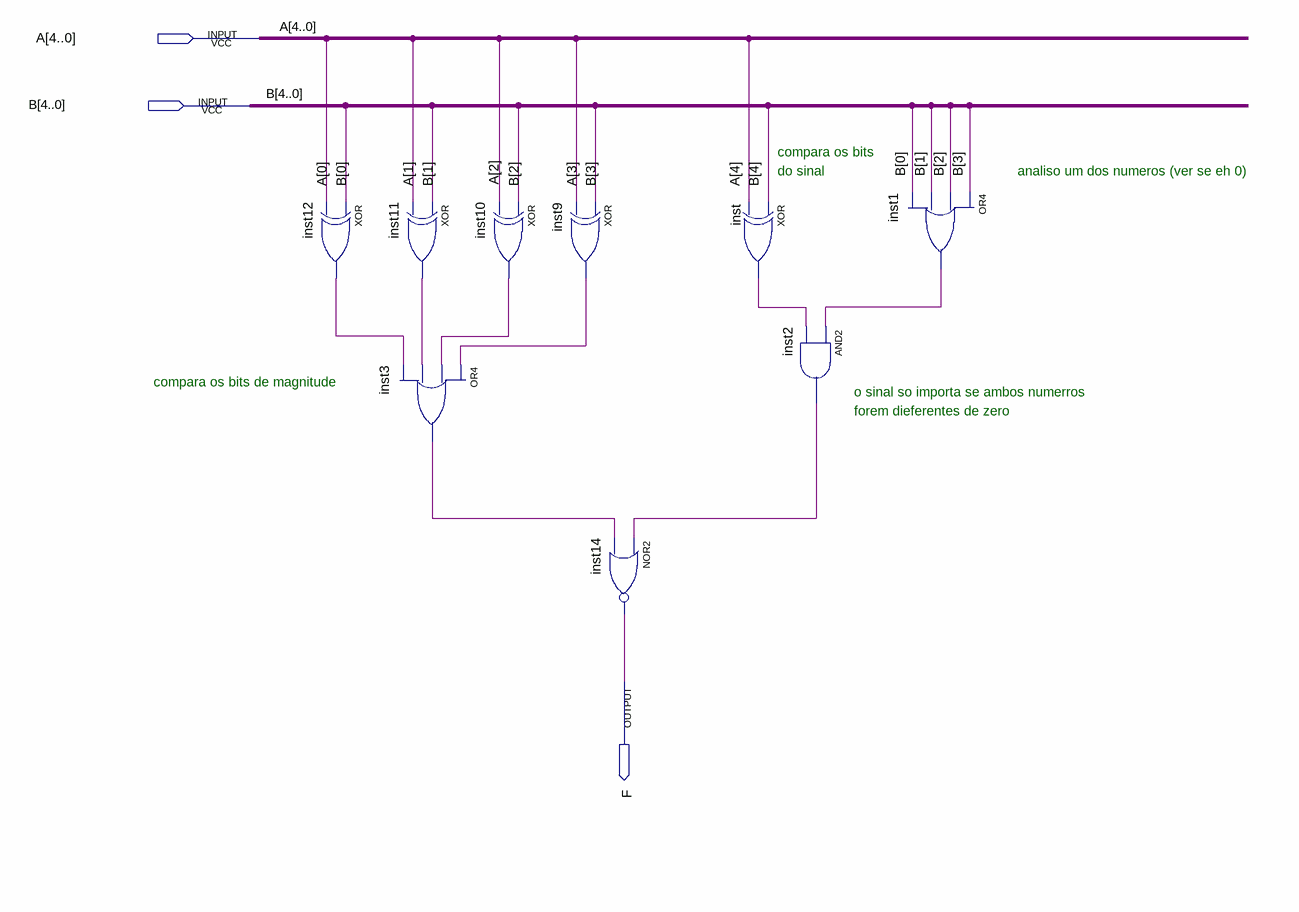
[diagram p0: schematic sheet]
// Quartus schematic comparador_igual.bdf as structural Verilog: 9 symbols, 3 pins
module comparador_igual (
  input  [4:0] A,
  input  [4:0] B,
  output F
);

  wire inst1_out, inst2_out, inst3_out, inst9_out, inst10_out, inst11_out, inst12_out, inst_out;

  xor inst12 (inst12_out, B[0], A[0]);
  xor inst11 (inst11_out, B[1], A[1]);
  or inst3 (inst3_out, inst9_out, inst10_out, inst11_out, inst12_out);
  xor inst10 (inst10_out, B[2], A[2]);
  xor inst9 (inst9_out, B[3], A[3]);
  nor inst14 (F, inst2_out, inst3_out);
  xor inst (inst_out, B[4], A[4]);
  and inst2 (inst2_out, inst1_out, inst_out);
  or inst1 (inst1_out, B[3], B[2], B[1], B[0]);

  // Notes on the sheet:
  //   compara os bits
  //   do sinal
  //   analiso um dos numeros (ver se eh 0)
  //   compara os bits de magnitude
  //   o sinal so importa se ambos numerros
  //   forem dieferentes de zero
endmodule
